# EAGLE design RPI3_LVDS (EAGLE 7.4.0)
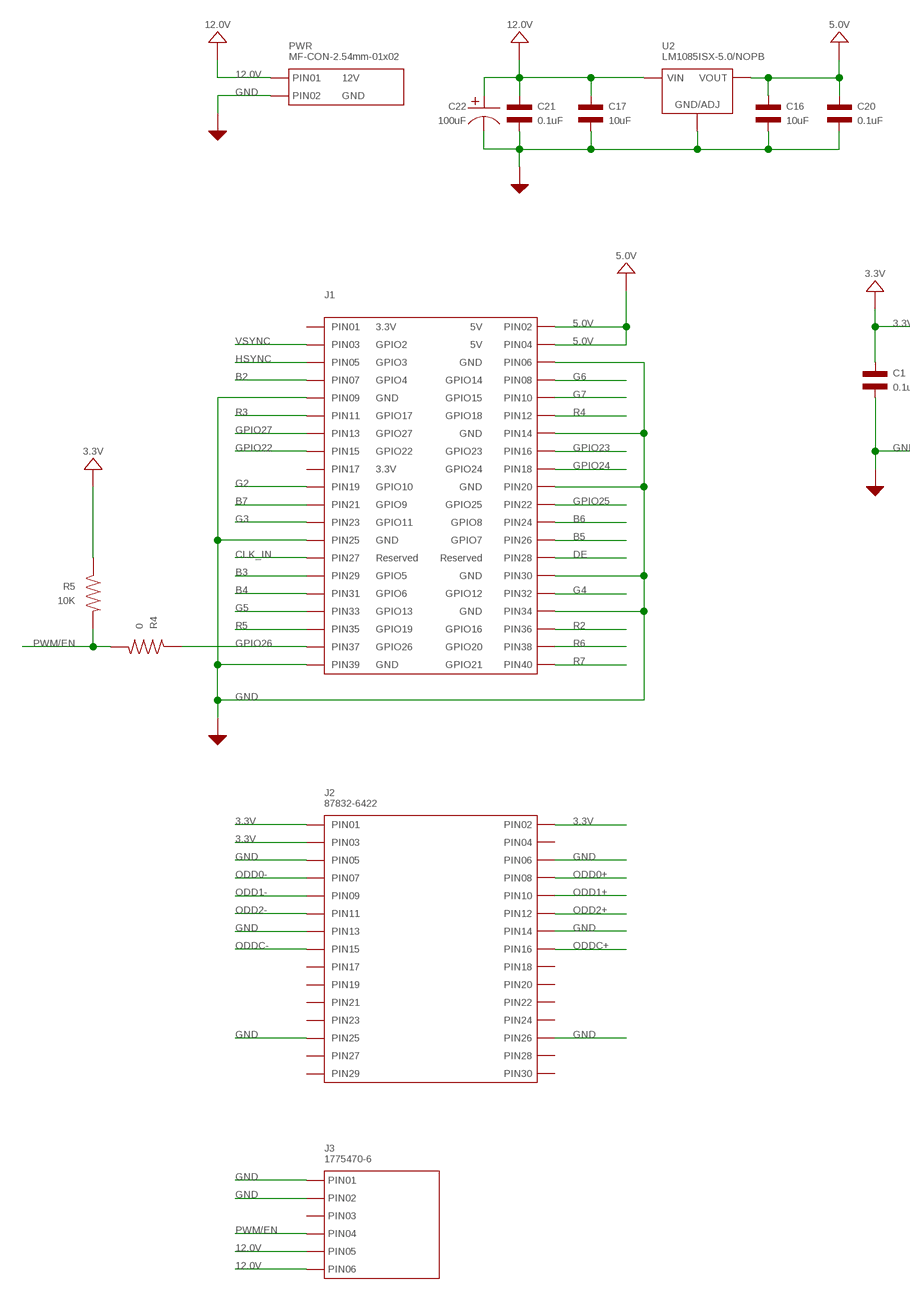
[diagram p0: schematic, sheet 1, part 1 of 2]
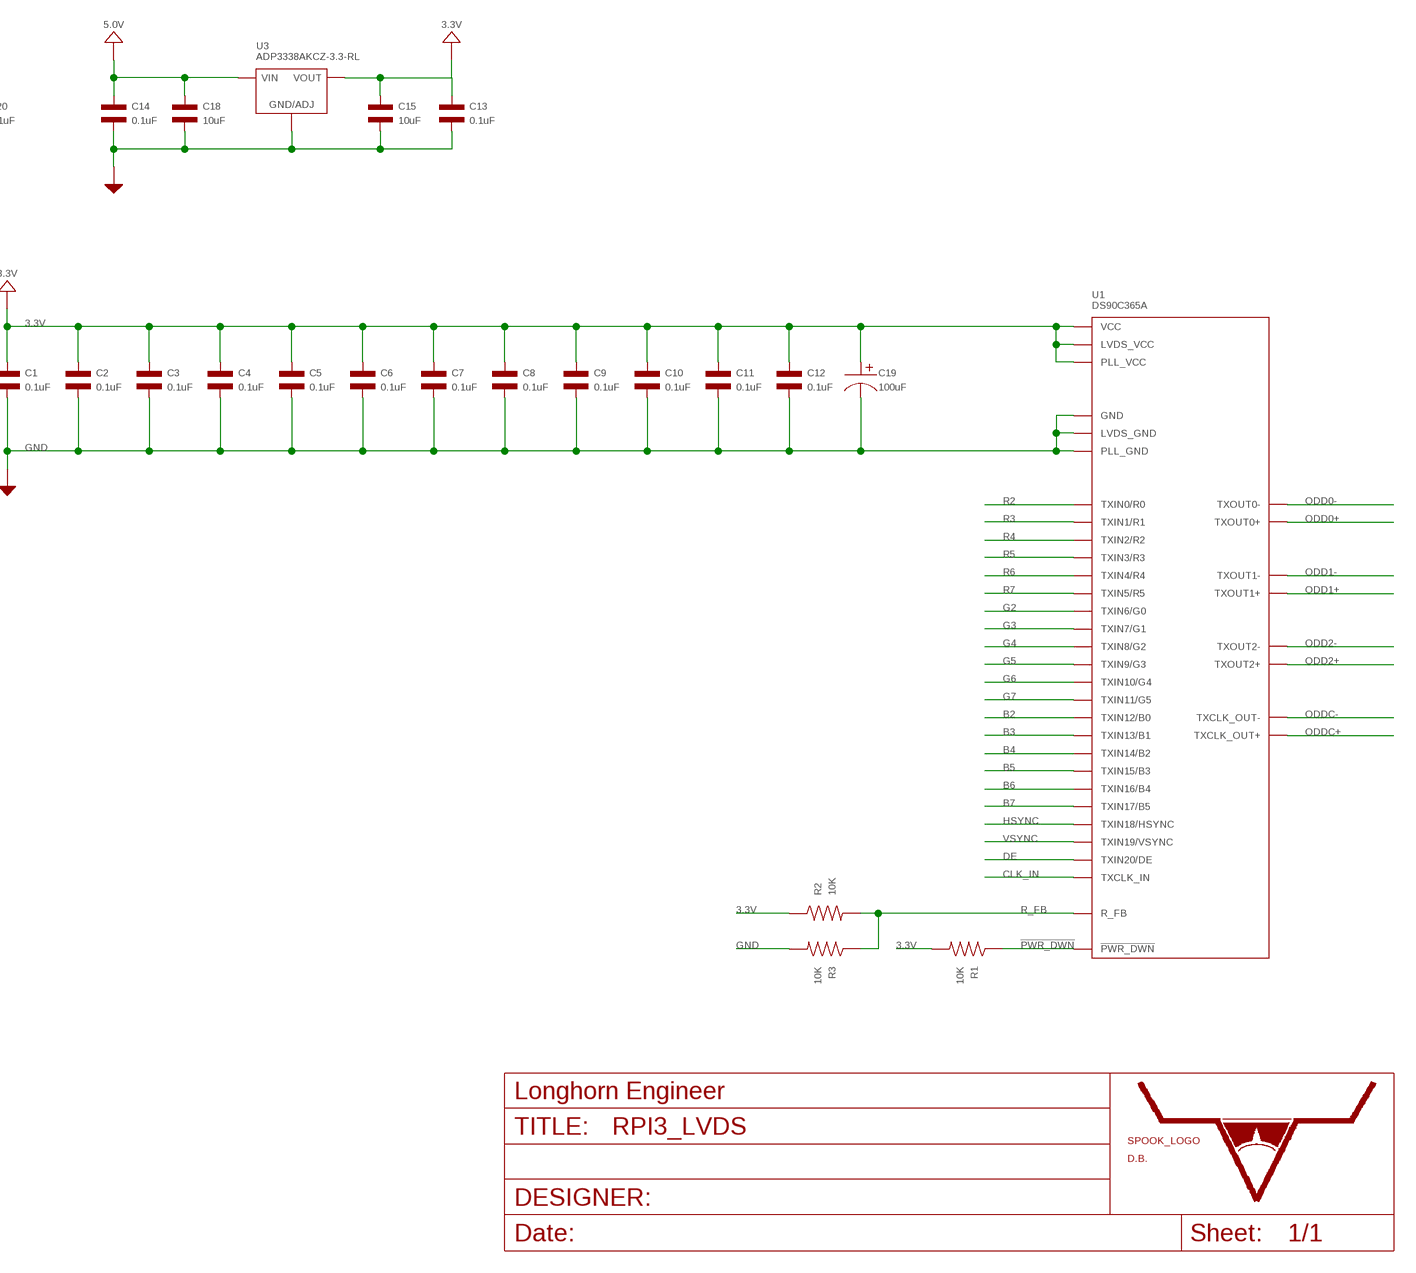
[diagram p1: schematic, sheet 1, part 2 of 2]

## Parts
C1  0.1uF  CAPACITOR_NP_0603  [C0603]
C2  0.1uF  CAPACITOR_NP_0603  [C0603]
C3  0.1uF  CAPACITOR_NP_0603  [C0603]
C4  0.1uF  CAPACITOR_NP_0603  [C0603]
C5  0.1uF  CAPACITOR_NP_0603  [C0603]
C6  0.1uF  CAPACITOR_NP_0603  [C0603]
C7  0.1uF  CAPACITOR_NP_0603  [C0603]
C8  0.1uF  CAPACITOR_NP_0603  [C0603]
C9  0.1uF  CAPACITOR_NP_0603  [C0603]
C10  0.1uF  CAPACITOR_NP_0603  [C0603]
C11  0.1uF  CAPACITOR_NP_0603  [C0603]
C12  0.1uF  CAPACITOR_NP_0603  [C0603]
C13  0.1uF  CAPACITOR_NP_0603  [C0603]
C14  0.1uF  CAPACITOR_NP_0603  [C0603]
C15  10uF  CAPACITOR_NP_1206  [C1206]
C16  10uF  CAPACITOR_NP_1206  [C1206]
C17  10uF  CAPACITOR_NP_1206  [C1206]
C18  10uF  CAPACITOR_NP_1206  [C1206]
C19  100uF  CAPACITOR_P_6.3MM  [CP6.3MM]
C20  0.1uF  CAPACITOR_NP_0603  [C0603]
C21  0.1uF  CAPACITOR_NP_0603  [C0603]
C22  100uF  CAPACITOR_P_6.3MM  [CP6.3MM]
J1  CON_02X202.54MM_PIN_HEADER  [2.54MM_02X20_PIN_HEADER]
J2  87832-6422  CON_02X15_87832-6422  [87832-6422]
J3  1775470-6  CON_01X06_1775470-6  [1775470-6]
LOGO1  SPOOKY_LOGOSPOOKY_LOGO  [SPOOKY_LOGO]
PWR  MF-CON-2.54mm-01x02  CON_01X02_PTH_2.54MM  [PTH_2.54MM_01X02]
R1  10K  RESISTOR_0603  [R0603]
R2  10K  RESISTOR_0603  [R0603]
R3  10K  RESISTOR_0603  [R0603]
R4  0  RESISTOR_0603  [R0603]
R5  10K  RESISTOR_0603  [R0603]
U1  DS90C365A  [DS90C365A_TSSOP-48]
U2  LM1085ISX-5.0/NOPB  LINEAR_VOTLAGE_REGULATORS_LM1085  [LM1085_TO-263-3]
U3  ADP3338AKCZ-3.3-RL  LINEAR_VOTLAGE_REGULATORS_ADP3338  [ADP3338_SOT-223-3]
U$14  LHE_FRAME  [LHE_FRAME]
U$15  DB_LOGO_SILK_MEDIUM  [DB_SILK_MEDIUM]

## Nets
3.3V: C1.P$1 C2.P$1 C3.P$1 C4.P$1 C5.P$1 C6.P$1 C7.P$1 C8.P$1 C9.P$1 C10.P$1 C11.P$1 C12.P$1 C13.P$1 C15.P$1 C19.P$1 J2.P$1(PIN0) J2.P$2(PIN1) J2.P$3(PIN2) R1.P$2 R2.P$1 R5.P$1 U1.P$2(VCC) U1.P$8(VCC) U1.P$21(VCC) U1.P$29(PLL_VCC) U1.P$37(LVDS_VCC) U3.2(OUT) U3.PAD(OUT)
5.0V: C14.P$1 C16.P$1 C18.P$1 C20.P$1 J1.2 J1.4 U2.P$2(OUT) U2.P$4(OUT) U3.3(IN)
12.0V: C17.P$1 C21.P$1 C22.P$1 J3.P$5 J3.P$6 PWR.P$1(PIN1) U2.P$3(IN)
!PWR_DWN: R1.P$1 U1.P$27(!PWR_DWN)
B2: J1.7 U1.P$13(TXIN12/B0)
B3: J1.29 U1.P$15(TXIN13/B1)
B4: J1.31 U1.P$16(TXIN14/B2)
B5: J1.26 U1.P$18(TXIN15/B3)
B6: J1.24 U1.P$19(TXIN16/B4)
B7: J1.21 U1.P$20(TXIN17/B5)
CLK_IN: J1.27 U1.P$26(TXCLK_IN)
DE: J1.28 U1.P$25(TXIN20/DE)
G2: J1.19 U1.P$4(TXIN6/G0)
G3: J1.23 U1.P$6(TXIN7/G1)
G4: J1.32 U1.P$7(TXIN8/G2)
G5: J1.33 U1.P$9(TXIN9/G3)
G6: J1.8 U1.P$10(TXIN10/G4)
G7: J1.10 U1.P$12(TXIN11/G5)
GND: C1.P$2 C2.P$2 C3.P$2 C4.P$2 C5.P$2 C6.P$2 C7.P$2 C8.P$2 C9.P$2 C10.P$2 C11.P$2 C12.P$2 C13.P$2 C14.P$2 C15.P$2 C16.P$2 C17.P$2 C18.P$2 C19.P$2 C20.P$2 C21.P$2 C22.P$2 J1.6 J1.9 J1.14 J1.20 J1.25 J1.30 J1.34 J1.39 J2.P$5(PIN4) J2.P$6(PIN5) J2.P$13(PIN12) J2.P$14(PIN13) J2.P$25(PIN24) J2.P$26(PIN25) J3.P$1 J3.P$2 PWR.P$2(PIN2) R3.P$2 U1.P$5(GND) U1.P$11(GND) U1.P$17(GND) U1.P$24(GND) U1.P$28(PLL_GND) U1.P$30(PLL_GND) U1.P$31(LVDS_GND) U1.P$36(LVDS_GND) U1.P$42(LVDS_GND) U1.P$46(GND) U2.P$1(GND) U3.1(GND)
GPIO22: J1.15
GPIO23: J1.16
GPIO24: J1.18
GPIO25: J1.22
GPIO26: J1.37 R4.P$1
GPIO27: J1.13
HSYNC: J1.5 U1.P$22(TXIN18/HSYNC)
ODD0+: J2.P$8(PIN7) U1.P$40(TXOUT0+)
ODD0-: J2.P$7(PIN6) U1.P$41(TXOUT0-)
ODD1+: J2.P$10(PIN9) U1.P$38(TXOUT1+)
ODD1-: J2.P$9(PIN8) U1.P$39(TXOUT1-)
ODD2+: J2.P$12(PIN11) U1.P$34(TXOUT2+)
ODD2-: J2.P$11(PIN10) U1.P$35(TXOUT2-)
ODDC+: J2.P$16(PIN15) U1.P$32(TXCLK_OUT+)
ODDC-: J2.P$15(PIN14) U1.P$33(TXCLK_OUT-)
PWM/EN: J3.P$4 R4.P$2 R5.P$2
R2: J1.36 U1.P$44(TXIN0/R0)
R3: J1.11 U1.P$45(TXIN1/R1)
R4: J1.12 U1.P$47(TXIN2/R2)
R5: J1.35 U1.P$48(TXIN3/R3)
R6: J1.38 U1.P$1(TXIN4/R4)
R7: J1.40 U1.P$3(TXIN5/R5)
R_FB: R2.P$2 R3.P$1 U1.P$14(R_FB)
VSYNC: J1.3 U1.P$23(TXIN19/VSYNC)
Unconnected: J1.1 J1.17 J2.P$4(PIN3) J2.P$17(PIN16) J2.P$18(PIN17) J2.P$19(PIN18) J2.P$20(PIN19) J2.P$21(PIN20) J2.P$22(PIN21) J2.P$23(PIN22) J2.P$24(PIN23) J2.P$27(PIN26) J2.P$28(PIN27) J2.P$29(PIN28) J2.P$30(PIN29) J3.P$3

## Library data of the parts
C1-C18 C20 C21 = MF_Passives:CAPACITOR_NP: Library: MF_Passives Description: Device for Non-Polarized Capacitors. Manufacture part number (MPN) can be added via Attributes. Check https://factory.macrofab.com/parts for the house parts list.; POPULATE: 1
C19 C22 = MF_Passives:CAPACITOR_P: Library: MF_Passives Description: Device for Polarized Capacitors. Manufacture part number (MPN), Voltage Rating, and Tolerance can be added via Attributes. Check https://factory.macrofab.com/parts for the house parts list.; POPULATE: 1
J1 = PP_Connectors:CON_02X20; LABEL01: 3.3V; LABEL02: 5V; LABEL03: GPIO2; LABEL04: 5V; LABEL05: GPIO3; LABEL06: GND; LABEL07: GPIO4; LABEL08: GPIO14; LABEL09: GND; LABEL10: GPIO15; LABEL11: GPIO17; LABEL12: GPIO18; LABEL13: GPIO27; LABEL14: GND; LABEL15: GPIO22; LABEL16: GPIO23; LABEL17: 3.3V; LABEL18: GPIO24; LABEL19: GPIO10; LABEL20: GND; LABEL21: GPIO9; LABEL22: GPIO25; LABEL23: GPIO11; LABEL24: GPIO8; LABEL25: GND; LABEL26: GPIO7; LABEL27: Reserved; LABEL28: Reserved; LABEL29: GPIO5; LABEL30: GND; LABEL31: GPIO6; LABEL32: GPIO12; LABEL33: GPIO13; LABEL34: GND; LABEL35: GPIO19; LABEL36: GPIO16; LABEL37: GPIO26; LABEL38: GPIO20; LABEL39: GND; LABEL40: GPIO21; POPULATE: 1
J2 = PP_Connectors:CON_02X15; POPULATE: 1
J3 = PP_Connectors:CON_01X06: 6 pin connectors; POPULATE: 1
LOGO1 = PP_Aesthetics:SPOOKY_LOGO
PWR = MF_Connectors:CON_01X02: Library: MF_Connectors Description: Header Connector with 02 Positions and 01 Rows. Use the LABEL Attribute to label the pin on the schematic and PCB. You can remove the attributes on the PCB by using the SMASH function on the part and then deleting the text.; HOUSEPART: YES; LABEL01: 12V; LABEL02: GND; MPN: MF-CON-2.54mm-01x02; POPULATE: 1; URL: https://factory.macrofab.com/part/MF-CON-2.54mm-01x02
R1-R5 = MF_Passives:RESISTOR: Library: MF_Passives Description: Device for Resistors. Manufacture part number (MPN), Voltage, Tolerance, and Wattage Rating can be added via Attributes. Check https://factory.macrofab.com/parts for the house parts list.; POPULATE: 1
U1 = PP_DigitalIC:DS90C365A
U2 U3 = PP_PowerIC:LINEAR_VOTLAGE_REGULATORS
U$14 = PP_Aesthetics:LHE_FRAME; DNAME: Parker Dillmann; REVNUM: REV: 3
U$15 = PP_Aesthetics:DB_LOGO

## Board
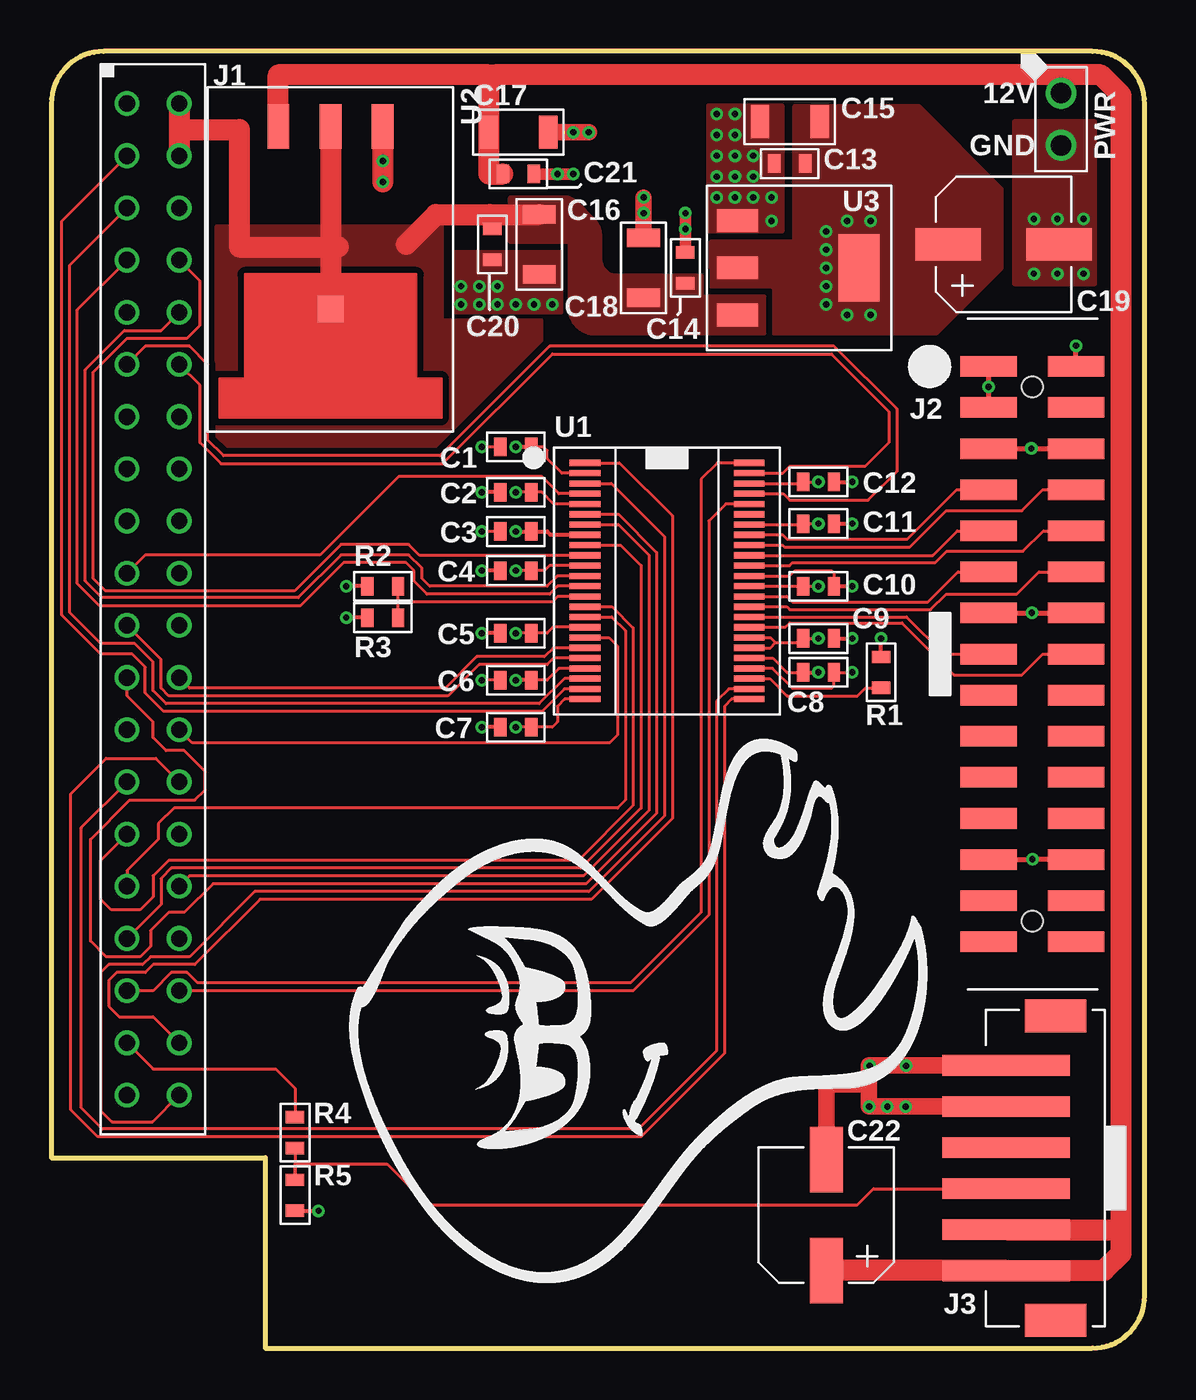
[diagram p2: board, top side]
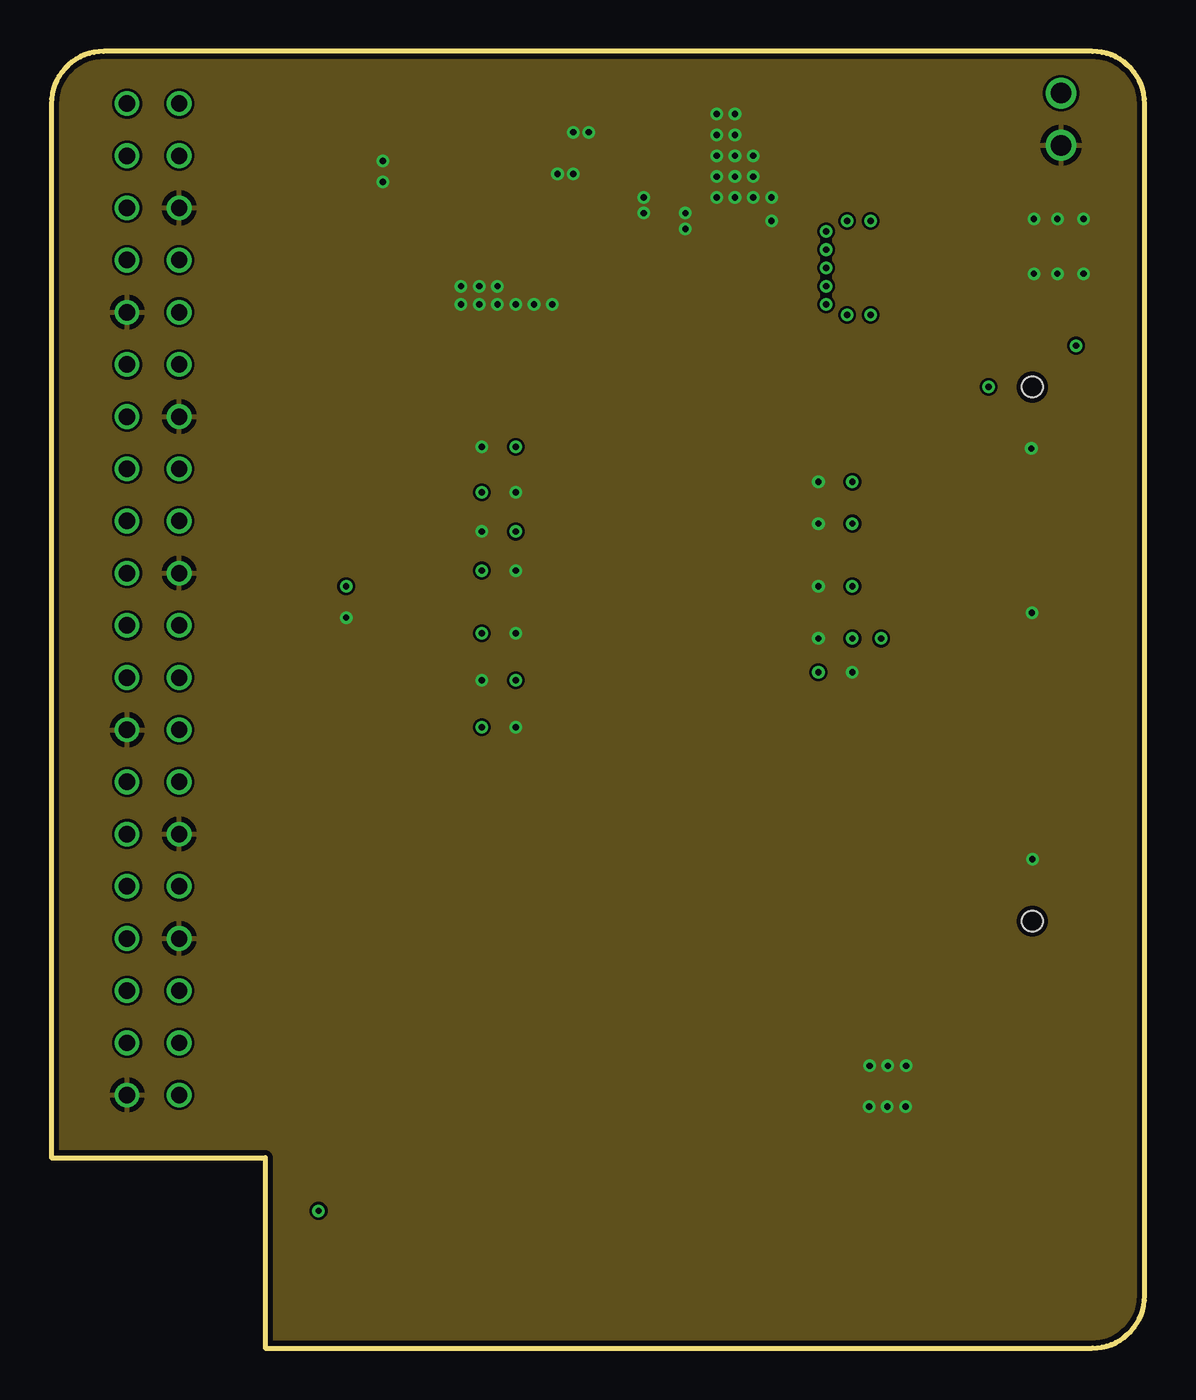
[diagram p3: board, inner layer Route2]
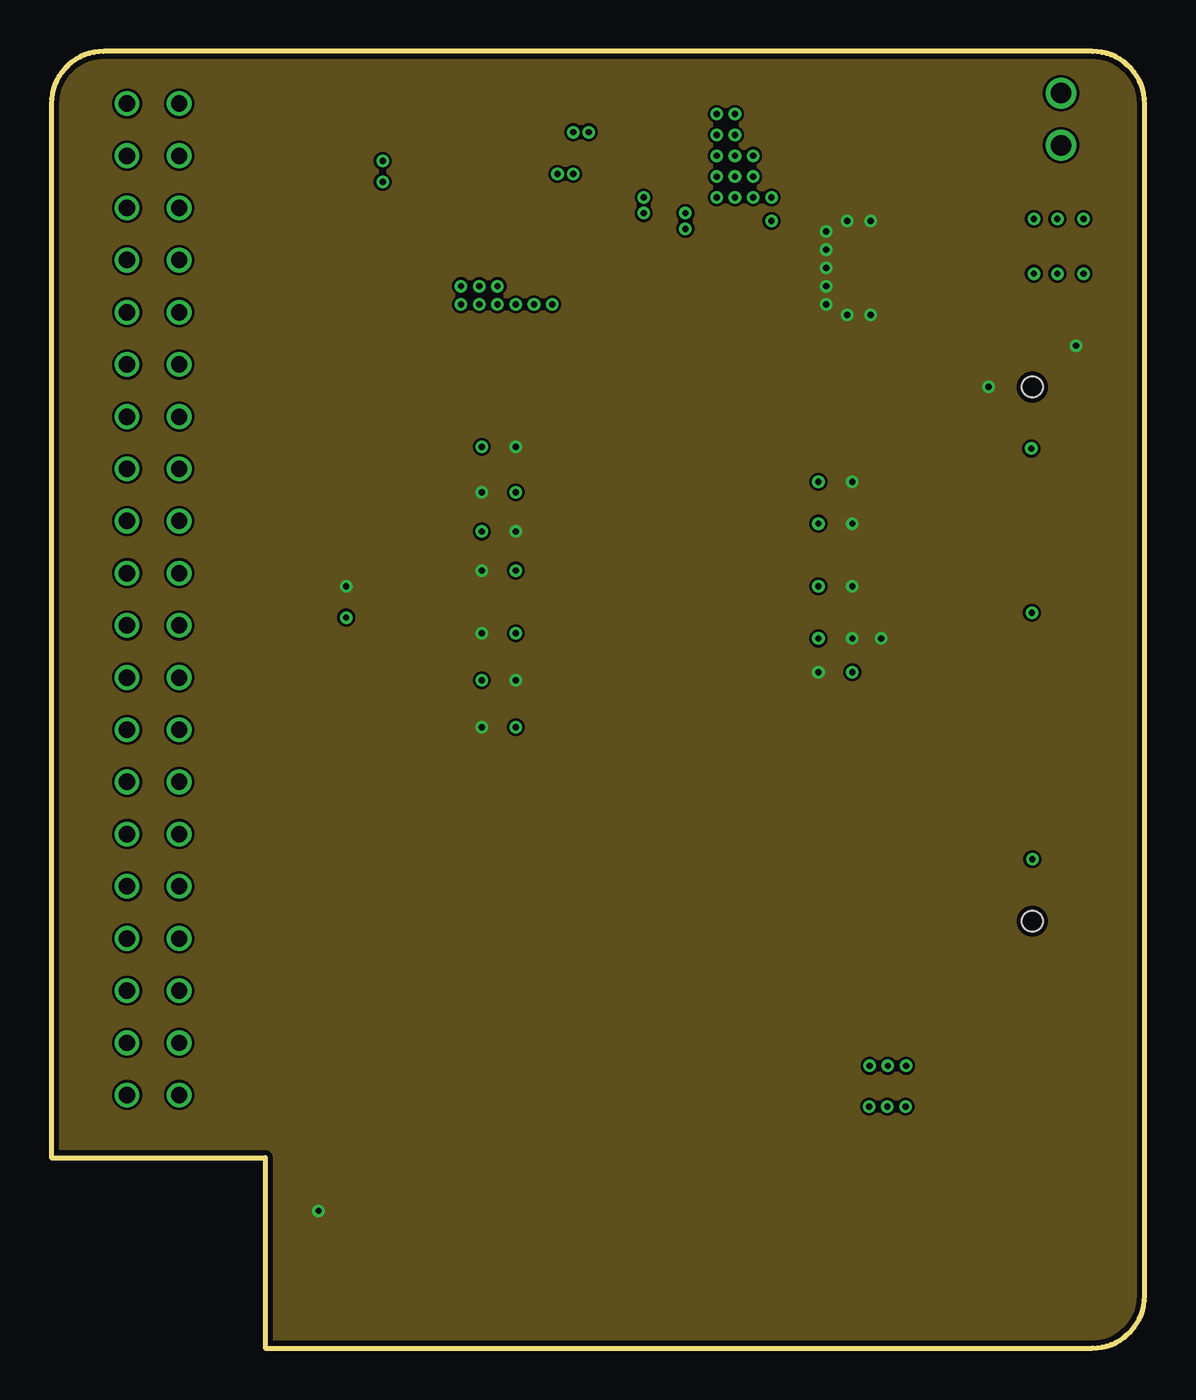
[diagram p4: board, inner layer Route15]
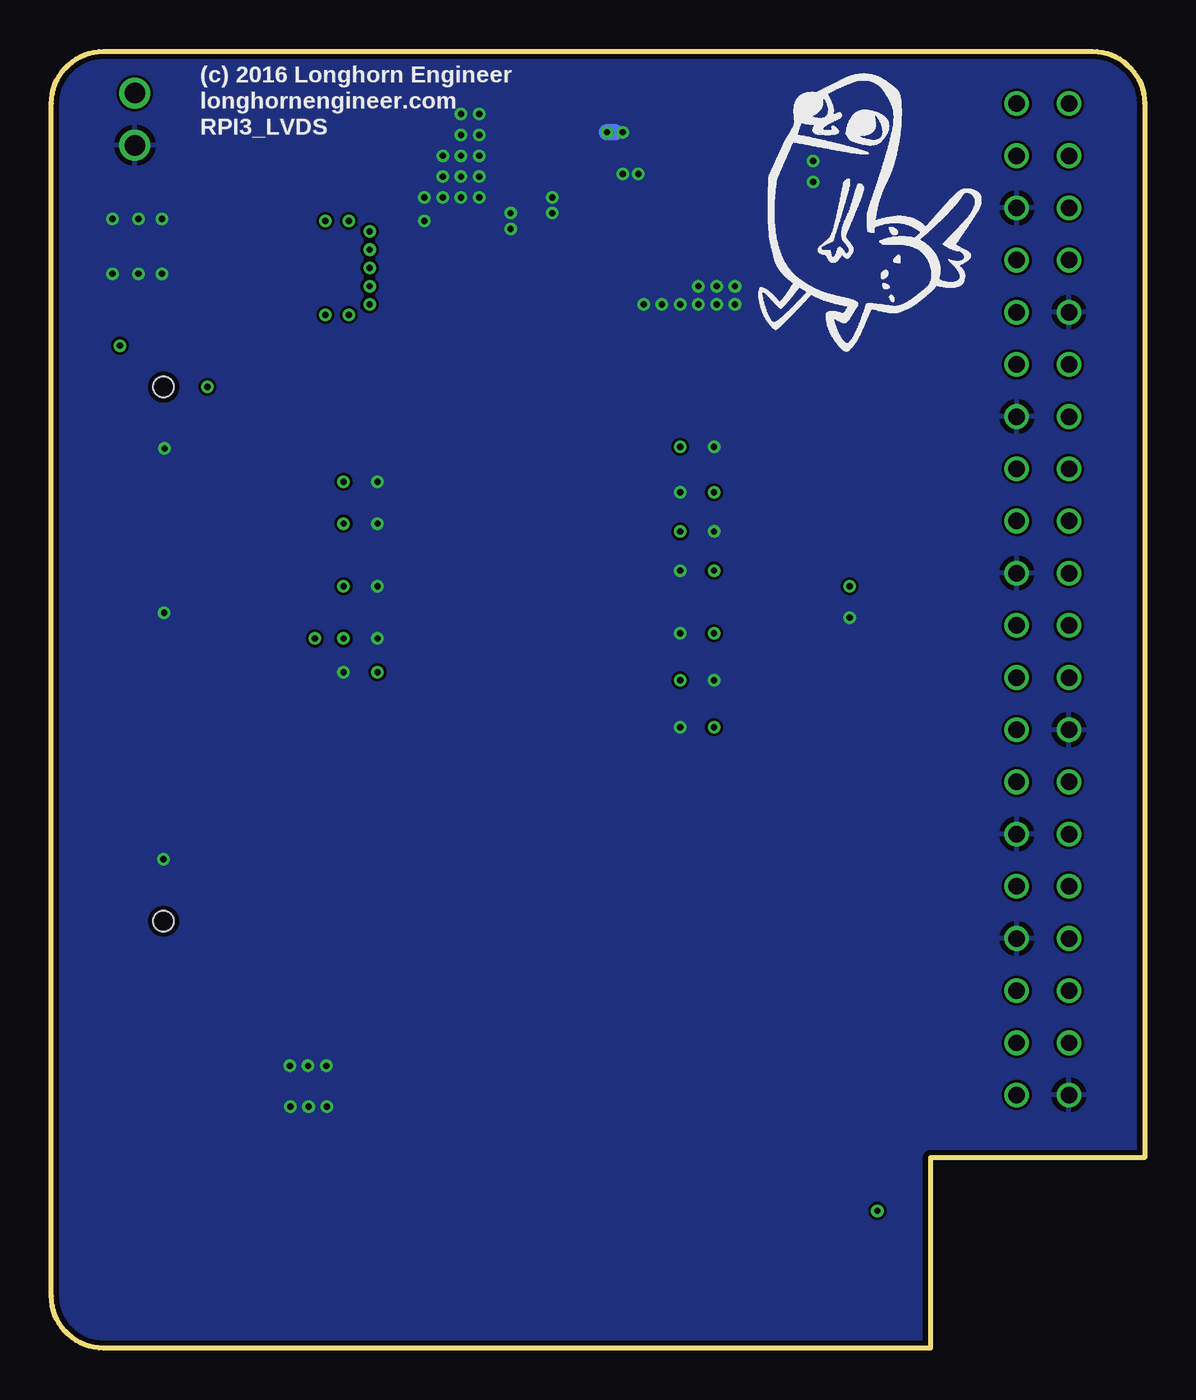
[diagram p5: board, bottom side, seen from below]

Size 53.21 x 63.12 mm. Coordinates in mm from the lower left corner, seen from the top.
Outline: 0,60.58 0,9.27 10.41,9.27 10.41,0 50.67,0 arc90 53.21,2.54 53.21,60.58 arc90 50.67,63.12 2.54,63.12 arc90 0,60.58
Copper layers (1*2*15*16): Top 0.035mm / dielectric 0.23mm / Route2 0.035mm / dielectric 0.93mm / Route15 0.035mm / dielectric 0.23mm / Bottom 0.035mm
Design rules "MF_Standard_4_Layer": minimum track width 5mil, minimum drill 12mil, track to track 5mil, track to pad 5mil, pad to pad 5mil, via to via 5mil, smd to smd 0mil, copper to edge 10mil, drill to drill 10mil, minimum pad ring 6mil, minimum via ring 6mil, stop-mask expansion 2mil, vias tented up to drill 25mil, thermal gap 10mil

### Footprints (pad centres in the part's own frame; a part is rotated, then mirrored left to right if it is on the bottom)
C0603 = smd 0.6 x 0.9: P$1 -0.75,0; P$2 0.75,0
C1206 = smd 0.9 x 1.6: P$1 -1.45,0; P$2 1.45,0
CP6.3MM = smd 1.6 x 3.2: P$1 0,-2.7; P$2 0,2.7
2.54MM_02X20_PIN_HEADER = drill 0.8: 1 -1.27,24.13; 2 1.27,24.13; 3 -1.27,21.59; 4 1.27,21.59; 5 -1.27,19.05; 6 1.27,19.05; 7 -1.27,16.51; 8 1.27,16.51; 9 -1.27,13.97; 10 1.27,13.97; 11 -1.27,11.43; 12 1.27,11.43; 13 -1.27,8.89; 14 1.27,8.89; 15 -1.27,6.35; 16 1.27,6.35; 17 -1.27,3.81; 18 1.27,3.81; 19 -1.27,1.27; 20 1.27,1.27; 21 -1.27,-1.27; 22 1.27,-1.27; 23 -1.27,-3.81; 24 1.27,-3.81; 25 -1.27,-6.35; 26 1.27,-6.35; 27 -1.27,-8.89; 28 1.27,-8.89; 29 -1.27,-11.43; 30 1.27,-11.43; 31 -1.27,-13.97; 32 1.27,-13.97; 33 -1.27,-16.51; 34 1.27,-16.51; 35 -1.27,-19.05; 36 1.27,-19.05; 37 -1.27,-21.59; 38 1.27,-21.59; 39 -1.27,-24.13; 40 1.27,-24.13
87832-6422 = smd 1 x 2.75: P$1 -14,-2.125; P$2 -14,2.125; P$3 -12,-2.125; P$4 -12,2.125; P$5 -10,-2.125; P$6 -10,2.125; P$7 -8,-2.125; P$8 -8,2.125; P$9 -6,-2.125; P$10 -6,2.125; P$11 -4,-2.125; P$12 -4,2.125; P$13 -2,-2.125; P$14 -2,2.125; P$15 0,-2.125; P$16 0,2.125; P$17 2,-2.125; P$18 2,2.125; P$19 4,-2.125; P$20 4,2.125; P$21 6,-2.125; P$22 6,2.125; P$23 8,-2.125; P$24 8,2.125; P$25 10,-2.125; P$26 10,2.125; P$27 12,-2.125; P$28 12,2.125; P$29 14,-2.125; P$30 14,2.125 | hole 1: -13,0; 13,0
1775470-6 = smd 1 x 6.2: P$1 5,0; P$2 3,0; P$3 1,0; P$4 -1,0; P$5 -3,0; P$6 -5,0 | smd 1.6 x 3: S0 -7.4,-2.4; S1 7.4,-2.4
PTH_2.54MM_01X02 = drill 1: P$1 -1.27,0; P$2 1.27,0
R0603 = smd 0.6 x 0.9: P$1 -0.75,0; P$2 0.75,0
DS90C365A_TSSOP-48 = smd 1.5 x 0.3: P$1 -4,5.75; P$2 -4,5.25; P$3 -4,4.75; P$4 -4,4.25; P$5 -4,3.75; P$6 -4,3.25; P$7 -4,2.75; P$8 -4,2.25; P$9 -4,1.75; P$10 -4,1.25; P$11 -4,0.75; P$12 -4,0.25; P$13 -4,-0.25; P$14 -4,-0.75; P$15 -4,-1.25; P$16 -4,-1.75; P$17 -4,-2.25; P$18 -4,-2.75; P$19 -4,-3.25; P$20 -4,-3.75; P$21 -4,-4.25; P$22 -4,-4.75; P$23 -4,-5.25; P$24 -4,-5.75; P$25 4,-5.75; P$26 4,-5.25; P$27 4,-4.75; P$28 4,-4.25; P$29 4,-3.75; P$30 4,-3.25; P$31 4,-2.75; P$32 4,-2.25; P$33 4,-1.75; P$34 4,-1.25; P$35 4,-0.75; P$36 4,-0.25; P$37 4,0.25; P$38 4,0.75; P$39 4,1.25; P$40 4,1.75; P$41 4,2.25; P$42 4,2.75; P$43 4,3.25; P$44 4,3.75; P$45 4,4.25; P$46 4,4.75; P$47 4,5.25; P$48 4,5.75
LM1085_TO-263-3 = smd 2.159 x 1.067: P$1 -6.35,2.54; P$2 -6.35,0; P$3 -6.35,-2.54 | smd 1.27 x 1.27: P$4 2.54,0
ADP3338_SOT-223-3 = smd 1.1 x 2: 1 -2.3,-2.54; 2 0,-2.54; 3 2.3,-2.54 | smd 3.3 x 2: PAD 0,3.36

### Placement (x,y rotation side)
C1  22.61,43.87 180 top
C2  22.61,41.66 0 top
C3  22.61,39.75 180 top
C4  22.61,37.85 0 top
C5  22.61,34.8 0 top
C6  22.61,32.51 180 top
C7  22.61,30.23 0 top
C8  37.34,32.89 0 top
C9  37.34,34.54 180 top
C10  37.34,37.08 180 top
C11  37.34,40.13 180 top
C12  37.34,42.16 180 top
C13  35.94,57.66 180 top
C14  30.86,52.58 90 top
C15  35.94,59.69 180 top
C16  23.75,53.72 270 top
C17  22.73,59.18 0 top
C18  28.83,52.58 90 top
C19  46.35,53.72 270 top
C20  21.46,53.72 270 top
C21  22.73,57.15 0 top
C22  37.72,6.48 0 top
J1  4.95,36.45 0 top
J2  47.75,33.78 270 top
J3  46.48,8.76 90 top
LOGO1  42.67,3.17 90 top
PWR  49.15,59.82 270 top
R1  40.39,32.89 90 top
R2  16.13,37.08 0 top
R3  16.13,35.56 180 top
R4  11.86,10.49 270 top
R5  11.86,7.44 90 top
U1  29.97,37.34 0 top
U2  13.59,53.11 270 top
U3  35.94,52.58 270 top
U$14  45.97,56.52 0 bottom
U$15  18.8,48.51 0 bottom

### Tracks (layer width: path | path; a pad name or v marks a point on that pad's centre or on a via)
3.3V  (via drill 0.3)
  Top 0.152: U1.P$21 24.71,33.09 24.13,32.51 C6.P$1 | U1.P$2 24.85,42.59 24.13,43.31 24.13,43.69 23.95,43.87 C1.P$1 | U1.P$29 35.12,33.59 35.81,32.89 C8.P$1 | U1.P$37 35.94,37.59 36.2,37.85 37.97,37.85 38.1,37.72 38.1,37.1 C10.P$1
  Top 0.203: C11.P$1 v38.99,40.13 | C12.P$1 v38.99,42.16 | C10.P$1 v38.99,37.08 | C9.P$1 v38.99,34.54 | C8.P$1 v37.34,32.89 | R1.P$2 v40.39,34.54 | C1.P$1 v22.61,43.87 | C2.P$1 v20.95,41.66 | C4.P$1 v20.95,37.85 | C5.P$1 v20.95,34.8 | C7.P$1 v20.95,30.23 | C6.P$1 v22.61,32.51 | R5.P$1 13.01,6.69 v13.01,6.68 | R2.P$1 v14.35,37.08 | v22.61,39.75 C3.P$1 24.13,39.75 24.29,39.59 U1.P$8
  Top 0.254: J2.P$3 v45.63,46.79 | v45.63,46.79 v45.62,46.79 | v45.63,46.79 J2.P$1 | J2.P$2 v49.88,48.79
  other vias: 37.72,52.58 37.72,53.47 37.72,54.36 37.72,51.69 37.72,50.8 38.73,50.29 39.88,50.29 38.73,54.86 39.88,54.86
  pour Top (isolate 0.305, rank 3, no thermals): 32.13,53.85 36.2,53.85 36.2,60.45 42.19,60.45 46.23,56.42 46.23,52.58 43.05,49.4 35.18,49.4 35.18,51.56 32.13,51.56
  pour Route15: 50.67,0 10.41,0 10.41,9.27 0,9.27 0,60.58 arc-90 2.54,63.12 50.67,63.12 arc-90 53.21,60.58 53.21,2.54 arc-90
5.0V
  Top 0.305: C20.P$1 21.34,54.6 21.34,55.17
  Top 1.016: 17.27,53.72 18.72,55.17 21.34,55.17 C16.P$1 | U2.P$2 13.59,53.59 | 13.59,53.59 U2.P$4 | J1.4 J1.2 6.22,59.31 9.14,59.31 9.14,53.59 13.59,53.59 | 13.59,53.59 13.97,53.59
  pour Top (no thermals): 22.35,56.01 24.87,56.01 arc-45 25.56,55.72 26.37,54.91 arc-45 26.67,54.19 26.67,53.04 arc45 26.91,52.47 27.04,52.33 arc45 27.37,52.2 31.62,52.2 31.62,51.18 34.67,51.18 34.67,49.4 26.47,49.4 arc-90 25.27,50.6 25.27,53.85 22.35,53.85
  pour Top (isolate 0.305, no thermals): 8,43.18 19.43,43.18 23.88,49.02 23.88,50.04 19.05,50.04 19.05,54.61 8,54.61
12.0V
  Top 1.016: 49.15,61.98 21.59,61.98 21.28,61.98 | 21.28,61.98 11.05,61.98 U2.P$3 | 21.28,61.98 C17.P$1 21.28,57.15 C21.P$1 | J3.P$6 46.48,3.78 | 46.48,3.78 C22.P$1 | 49.15,61.98 PWR.P$1 | 46.48,3.78 51.24,3.78 52.07,4.61 52.07,5.76 | 52.07,5.76 52.07,60.98 51.08,61.98 49.15,61.98 | J3.P$5 52.07,5.76
!PWR_DWN
  Top 0.152: U1.P$27 34.98,32.59 35.81,31.75 39.24,31.75 39.62,32.13 40.37,32.13 R1.P$1
B2
  Top 0.152: U1.P$13 24.64,37.09 24.26,36.7 18.29,36.7 17.65,37.34 17.65,37.85 17.27,38.23 14.22,38.23 12.12,36.12 2.36,36.12 1.27,37.21 1.27,50.55 J1.7
B3
  Top 0.152: U1.P$15 27.29,36.09 28.32,35.05 28.32,26.42 25.65,23.75 5.71,23.75 4.95,22.99 4.95,21.97 4.32,21.34 2.92,21.34 2.41,21.84 2.41,23.75 J1.29
B4
  Top 0.152: U1.P$16 27.28,35.59 27.94,34.92 27.94,26.67 27.56,26.29 5.97,26.29 5.21,25.53 5.21,24.77 3.68,23.24 J1.31
B5
  Top 0.152: U1.P$18 27.13,34.59 27.56,34.16 27.56,29.84 27.18,29.46 6.86,29.46 J1.26
B6
  Top 0.152: U1.P$19 24.44,34.09 24,33.66 20.7,33.66 19.18,32.13 6.73,32.13 J1.24
B7
  Top 0.152: U1.P$20 24.44,33.59 24.13,33.27 20.83,33.27 19.3,31.75 5.71,31.75 5.33,32.13 5.33,33.53 J1.21
CLK_IN
  Top 0.152: U1.P$26 32.98,32.09 32.38,31.5 32.38,14.48 28.57,10.67 2.49,10.67 1.46,11.7 1.46,25.34 J1.27
DE
  Top 0.152: U1.P$25 33.11,31.59 32.77,31.24 32.77,14.35 28.7,10.29 2.26,10.29 0.94,11.6 0.94,26.98 2.67,28.7 5.08,28.7 J1.28
G2
  Top 0.152: U1.P$4 24.71,41.59 23.88,42.42 16.89,42.42 13.08,38.61 4.57,38.61 J1.19
G3
  Top 0.152: U1.P$6 27.61,40.59 29.46,38.73 29.46,26.04 26.04,22.61 7.87,22.61 6.48,21.21 5.71,21.21 4.83,20.32 4.83,19.56 4.32,19.05 2.67,19.05 1.91,19.81 1.91,24.77 3.81,26.67 6.99,26.67 7.49,27.18 7.49,28.07 6.48,29.08 5.59,29.08 4.95,29.72 4.95,30.48 3.68,31.75 J1.23
G4
  Top 0.152: U1.P$7 27.6,40.09 29.08,38.61 29.08,26.16 25.91,22.99 6.73,22.99 J1.32
G5
  Top 0.152: U1.P$9 27.71,39.09 28.7,38.1 28.7,26.29 25.78,23.37 5.84,23.37 5.33,22.86 5.33,21.59 J1.33
G6
  Top 0.152: U1.P$10 17.93,38.59 17.4,39.12 14.1,39.12 11.83,36.85 2.65,36.85 2.03,37.47 2.03,47.5 3.68,49.15 6.6,49.15 7.24,49.78 7.24,51.94 J1.8
G7
  Top 0.152: U1.P$12 24.63,37.59 24.13,37.08 18.41,37.08 18.03,37.47 18.03,37.97 17.4,38.61 14.1,38.61 12.02,36.53 2.46,36.53 1.65,37.34 1.65,47.62 3.56,49.53 5.33,49.53 J1.10
GND  (via drill 0.3)
  Top 0.152: U1.P$24 24.98,31.59 24.64,31.24 24.64,30.48 24.38,30.23 C7.P$2 v22.61,30.23 | U1.P$17 24.42,35.09 24.13,34.8 C5.P$2 v22.61,34.8 | U1.P$11 24.25,38.09 24,37.85 C4.P$2 v22.61,37.85 | U1.P$5 24.44,41.09 23.88,41.66 C2.P$2 v22.61,41.66 | U1.P$28 35.11,33.09 36.07,32.13 37.97,32.13 38.09,32.25 C8.P$2 v38.99,32.89 | U1.P$31 35.01,34.59 35.26,34.34 | U1.P$30 35,34.09 35.26,34.34 | 35.26,34.34 36.38,34.34 C9.P$2 v37.34,34.54 | U1.P$36 C10.P$2 v37.34,37.08 | U1.P$42 36.54,40.09 C11.P$2 v37.34,40.13 | U1.P$46 36.51,42.09 C12.P$2 v37.34,42.16 | C1.P$2 v20.95,43.87 | C3.P$2 v20.95,39.75 | C6.P$2 v20.95,32.51
  Top 0.203: R3.P$2 v14.35,35.56 | v39.8,11.76
  Top 0.254: J2.P$5 v47.7,43.79 J2.P$6 | J2.P$13 v47.73,35.79 J2.P$14 | J2.P$25 47.75,23.78 | J2.P$26 47.75,23.78 | 47.75,23.78 v47.75,23.8
  Top 0.559: C21.P$2 v25.4,57.15 | C14.P$2 v30.86,55.24
  Top 0.813: C17.P$2 v26.16,59.18 | C18.P$2 v28.83,56.01 | J3.P$1 39.8,13.76 39.8,12.83 | 39.8,12.83 v39.8,11.76 J3.P$2 | C22.P$2 37.72,12.83 39.8,12.83
  Top 1.016: U2.P$1 v16.13,56.77
  Bottom 0.813: v26.16,59.18 25.78,59.18
  other vias: 25.4,59.18 24.64,57.15 24.38,50.8 23.5,50.8 22.61,50.8 21.72,50.8 20.83,50.8 19.94,50.8 20.83,51.69 21.72,51.69 19.94,51.69 28.83,55.24 30.86,54.48 32.38,56.01 32.38,57.02 32.38,58.04 32.38,59.05 32.38,60.07 33.27,60.07 33.27,59.05 33.27,58.04 33.27,57.02 33.27,56.01 34.16,56.01 34.16,57.02 34.16,58.04 35.05,56.01 35.05,54.86 39.83,13.74 40.72,13.74 41.61,13.74 40.69,11.76 41.58,11.76 47.83,54.97 48.97,54.97 50.24,54.97 50.24,52.3 48.97,52.3 47.83,52.3 16.13,57.78
  pour Route2: 50.67,0 10.41,0 10.41,9.27 0,9.27 0,60.58 arc-90 2.54,63.12 50.67,63.12 arc-90 53.21,60.58 53.21,2.54 arc-90
  pour Top (no thermals): 19.68,53.34 24.79,53.34 24.79,50.42 19.68,50.42
  pour Top (no thermals): 32,54.36 32,60.48 35.56,60.48 35.56,54.36
  pour Top (no thermals): 46.86,59.69 46.86,51.82 50.8,51.82 50.8,59.69
  pour Bottom: 50.67,0 10.41,0 10.41,9.27 0,9.27 0,60.58 arc-90 2.54,63.12 50.67,63.12 arc-90 53.21,60.58 53.21,2.54 arc-90
GPIO26
  Top 0.152: J1.37 4.95,13.59 10.92,13.59 11.86,12.65 R4.P$1
HSYNC
  Top 0.152: U1.P$22 24.97,32.59 23.75,31.37 5.59,31.37 4.95,32 4.95,33.4 4.06,34.29 2.41,34.29 0.89,35.81 0.89,52.7 J1.5
ODD0+
  Top 0.152: U1.P$40 35.59,39.09 35.69,38.99 41.78,38.99 43.56,40.77 47.24,40.77 48.26,41.78 J2.P$8
ODD0-
  Top 0.152: U1.P$41 35.6,39.59 35.81,39.37 41.66,39.37 44.07,41.78 J2.P$7
ODD1+
  Top 0.152: U1.P$38 35.93,38.09 36.07,38.23 43.03,38.23 43.59,38.79 47.3,38.79 48.29,39.78 J2.P$10
ODD1-
  Top 0.152: U1.P$39 42.91,38.59 44.1,39.78 J2.P$9
ODD2+
  Top 0.152: U1.P$34 35.79,36.09 35.94,35.94 42.8,35.94 43.56,36.7 46.99,36.7 48.07,37.78 J2.P$12
ODD2-
  Top 0.152: U1.P$35 35.8,36.59 36.07,36.32 42.67,36.32 44.13,37.78 J2.P$11
ODDC+
  Top 0.152: U1.P$32 35.72,35.09 35.94,35.31 41.4,35.31 43.94,32.77 47.24,32.77 48.26,33.78 J2.P$16
ODDC-
  Top 0.152: U1.P$33 41.63,35.59 43.43,33.78 J2.P$15
PWM/EN
  Top 0.152: R4.P$2 R5.P$2 11.86,8.97 16.33,8.97 18.31,6.99 39.24,6.99 40.02,7.76 J3.P$4
R2
  Top 0.152: U1.P$44 32.83,41.09 32,40.26 32,21.08 28.32,17.4 J1.36
R3
  Top 0.152: U1.P$45 35.63,41.59 35.94,41.27 39.75,41.27 41.15,42.67 41.15,45.72 38.1,48.77 24.26,48.77 18.92,43.43 8.38,43.43 7.62,44.2 7.62,47.88 6.73,48.77 4.57,48.77 J1.11
R4
  Top 0.152: U1.P$47 35.6,42.59 35.94,42.93 39.62,42.93 40.77,44.07 40.77,45.59 37.97,48.39 24.38,48.39 19.05,43.05 8.26,43.05 7.24,44.07 7.24,46.86 J1.12
R5
  Top 0.152: U1.P$48 32.42,43.09 31.62,42.29 31.62,21.21 28.19,17.78 7.11,17.78 6.6,18.29 5.84,18.29 4.95,17.4 J1.35
R6
  Top 0.152: U1.P$1 27.65,43.09 30.23,40.51 30.23,25.78 26.29,21.84 10.16,21.84 6.99,18.67 4.95,18.67 4.57,18.29 3.17,18.29 2.79,17.91 2.79,16.64 3.3,16.13 4.95,16.13 J1.38
R7
  Top 0.152: U1.P$3 27.25,42.09 29.84,39.5 29.84,25.91 26.16,22.23 9.91,22.23 6.73,19.05 4.83,19.05 4.45,18.67 2.79,18.67 2.41,18.29 2.41,11.56 2.94,11.03 4.93,11.03 J1.40
R_FB
  Top 0.152: U1.P$14 24.65,36.59 24.38,36.32 16.88,36.32 | 16.88,36.32 R2.P$2 | R3.P$1 16.88,36.32
VSYNC
  Top 0.152: U1.P$23 24.98,32.09 23.88,30.99 5.46,30.99 4.57,31.88 4.57,33.15 3.94,33.78 2.41,33.78 0.51,35.69 0.51,54.86 J1.3